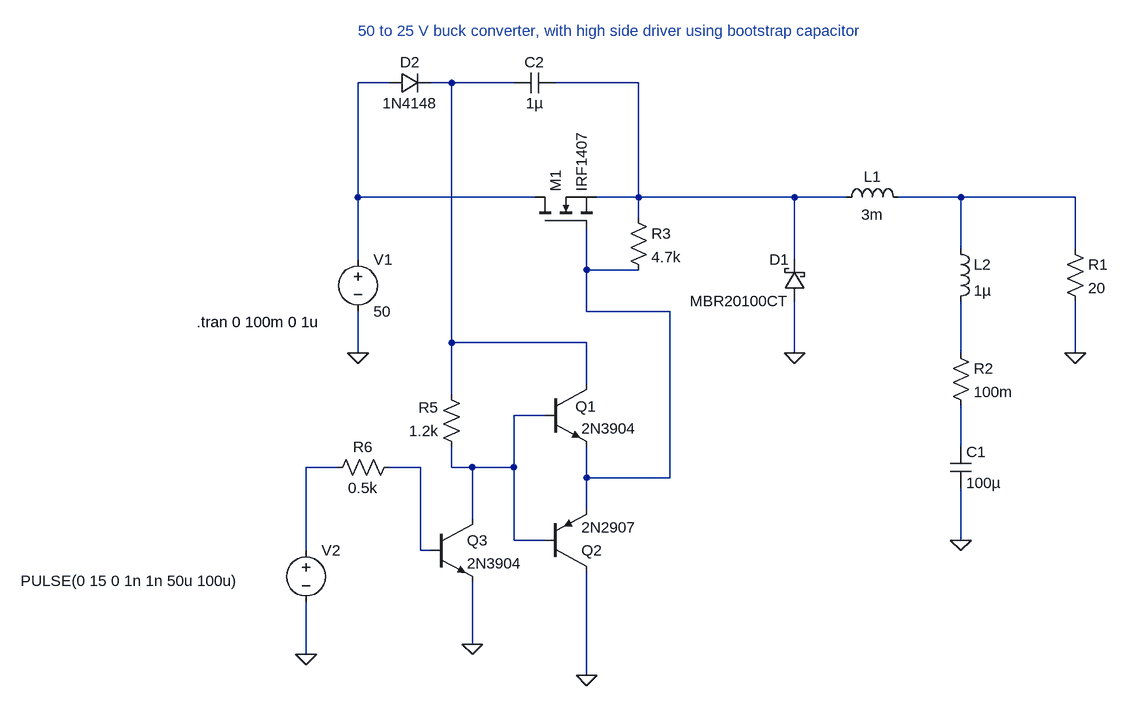
[diagram p0: schematic buck_converter-bootstrap-capacitor.asc]
buck_converter-bootstrap-capacitor.asc, the LTspice schematic file:
Version 4
SHEET 1 1340 916
WIRE -432 -144 -480 -144
WIRE -336 -144 -368 -144
WIRE -240 -144 -336 -144
WIRE -48 -144 -176 -144
WIRE -480 32 -480 -144
WIRE -208 32 -480 32
WIRE -48 32 -48 -144
WIRE -48 32 -112 32
WIRE 192 32 -48 32
WIRE 272 32 192 32
WIRE 448 32 352 32
WIRE 624 32 448 32
WIRE -48 64 -48 32
WIRE 448 112 448 32
WIRE 624 112 624 32
WIRE -480 128 -480 32
WIRE 192 128 192 32
WIRE -128 144 -128 80
WIRE -48 144 -128 144
WIRE -128 208 -128 144
WIRE 0 208 -128 208
WIRE -336 256 -336 -144
WIRE -128 256 -336 256
WIRE -480 272 -480 208
WIRE 192 272 192 192
WIRE 448 272 448 192
WIRE 624 272 624 192
WIRE -128 320 -128 256
WIRE -336 336 -336 256
WIRE -192 368 -240 368
WIRE 448 416 448 352
WIRE -512 448 -560 448
WIRE -384 448 -432 448
WIRE -336 448 -336 416
WIRE -304 448 -336 448
WIRE -240 448 -240 368
WIRE -240 448 -304 448
WIRE -128 464 -128 416
WIRE 0 464 0 208
WIRE 0 464 -128 464
WIRE -128 512 -128 464
WIRE -304 528 -304 448
WIRE -240 560 -240 448
WIRE -192 560 -240 560
WIRE 448 560 448 480
WIRE -560 576 -560 448
WIRE -384 576 -384 448
WIRE -368 576 -384 576
WIRE -304 720 -304 624
WIRE -560 736 -560 656
WIRE -128 768 -128 608
FLAG 192 272 0
FLAG -480 272 0
FLAG 448 560 0
FLAG 624 272 0
FLAG -304 720 0
FLAG -560 736 0
FLAG -128 768 0
SYMBOL voltage -480 112 R0
WINDOW 123 0 0 Left 0
WINDOW 39 0 0 Left 0
SYMATTR InstName V1
SYMATTR Value 50
SYMBOL nmos -208 80 R270
SYMATTR InstName M1
SYMATTR Value IRF1407
SYMBOL ind 256 48 R270
WINDOW 0 32 56 VTop 2
WINDOW 3 5 56 VBottom 2
SYMATTR InstName L1
SYMATTR Value 3m
SYMBOL schottky 208 192 R180
WINDOW 0 24 64 Left 2
WINDOW 3 24 0 Left 2
SYMATTR InstName D1
SYMATTR Value MBR20100CT
SYMATTR Description Diode
SYMATTR Type diode
SYMBOL cap 432 416 R0
SYMATTR InstName C1
SYMATTR Value 100µ
SYMBOL res 608 96 R0
SYMATTR InstName R1
SYMATTR Value 20
SYMBOL res 432 256 R0
SYMATTR InstName R2
SYMATTR Value 100m
SYMBOL ind 432 96 R0
SYMATTR InstName L2
SYMATTR Value 1µ
SYMBOL voltage -560 560 R0
WINDOW 3 -439 63 Left 2
WINDOW 123 0 0 Left 0
WINDOW 39 0 0 Left 0
SYMATTR Value PULSE(0 15 0 1n 1n 50u 100u)
SYMATTR InstName V2
SYMBOL res -64 48 R0
SYMATTR InstName R3
SYMATTR Value 4.7k
SYMBOL npn -192 320 R0
WINDOW 0 47 34 Left 2
SYMATTR InstName Q1
SYMATTR Value 2N3904
SYMBOL res -320 432 R180
WINDOW 0 36 76 Left 2
WINDOW 3 36 40 Left 2
SYMATTR InstName R5
SYMATTR Value 1.2k
SYMBOL pnp -192 608 M180
SYMATTR InstName Q2
SYMATTR Value 2N2907
SYMBOL cap -240 -128 R270
WINDOW 0 32 32 VTop 2
WINDOW 3 0 32 VBottom 2
SYMATTR InstName C2
SYMATTR Value 1µ
SYMBOL res -416 432 R90
WINDOW 0 0 56 VBottom 2
WINDOW 3 32 56 VTop 2
SYMATTR InstName R6
SYMATTR Value 0.5k
SYMBOL diode -432 -128 R270
WINDOW 0 32 32 VTop 2
WINDOW 3 0 32 VBottom 2
SYMATTR InstName D2
SYMATTR Value 1N4148
SYMBOL npn -368 528 R0
SYMATTR InstName Q3
SYMATTR Value 2N3904
TEXT -728 224 Left 2 !.tran 0 100m 0 1u
TEXT -480 -224 Left 2 ;50 to 25 V buck converter, with high side driver using bootstrap capacitor

The netlist it stands for:
* buck_converter-bootstrap-capacitor.asc
V1 N001 0 50
M1 N001 N005 N003 N003 IRF1407
L1 N003 N004 3m
D1 0 N003 MBR20100CT
C1 N008 0 100µ
R1 N004 0 20
R2 N006 N008 100m
L2 N004 N006 1µ
V2 N009 0 PULSE(0 15 0 1n 1n 50u 100u)
R3 N003 N005 4.7k
Q1 N002 N007 N005 0 2N3904
R5 N007 N002 1.2k
Q2 0 N007 N005 0 2N2907
C2 N002 N003 1µ
R6 N010 N009 0.5k
D2 N001 N002 1N4148
Q3 N007 N010 0 0 2N3904
.model D D
.lib standard.dio
.model NPN NPN
.model PNP PNP
.lib standard.bjt
.model NMOS NMOS
.model PMOS PMOS
.lib standard.mos
.tran 0 100m 0 1u
* 50 to 25 V buck converter, with high side driver using bootstrap capacitor
.backanno
.end